# Altium schematic sheet RTC.SchDoc
size A; SheetNumber: 1; SheetTotal: 1
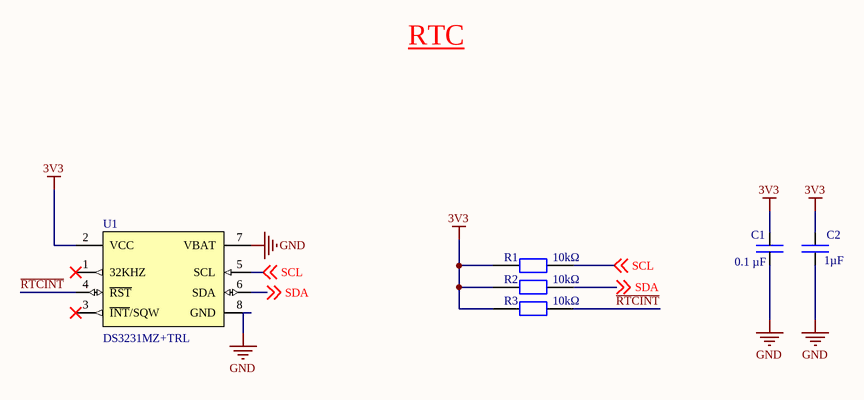
[diagram p0: RTC.SchDoc]

## Parts
C1  0.1 µF
C2  1µF
R1  10kΩ
R2  10kΩ
R3  10kΩ
U1  DS3231MZ+TRL  [DS3231MZ+TRL]

## Nets
3V3: C1.2 C2.1 R1.1 R2.1 R3.1 U1.2(VCC)
GND: C1.1 C2.2 U1.7(VBAT) U1.8(GND)
~{RTC}~{INT}: R3.2 U1.4(~{RST})
SCL: R1.2 U1.5(SCL) ; off-sheet SCL
SDA: R2.2 U1.6(SDA) ; off-sheet SDA

Not connected (* = marked no-connect by the designer): U1 1(32KHZ)* 3(~{INT}/SQW)*

## Notes on the sheet
- RTC

## Library data of the parts
C1 = C0402C104K7PACTU: Multilayer Ceramic Capacitors MLCC - SMD/SMT V 0.1uF X5R 0402 10%; Manufacturer: Yageo Group; Value: 100nF; Voltage Rating (DC): 4V; Supplier: DigiKey; Supplier Part Number: 399-14871-2-ND; Manufacturer Part Number: C0402C104K7PACTU; RoHS: Compliant; Category: Ceramic Capacitors; Stock: 10000; Pricing: 10000=0.01597, 20000=0.01478, 30000=0.01419, 50000=0.01353, 70000=0.01314, 100000=0.01277 (USD); Case/Package: 0402; China RoHS: Compliant; Dielectric: X5R; Dielectric Material: Ceramic; Height: 500µm; Lead Free: Lead Free; Length: 1mm; Lifecycle Status: Production; Max Operating Temperature: 85°C; Min Operating Temperature: -55°C; Mounting Technology: Surface Mount; Number of Terminals: 2; REACH SVHC: Yes; Width: 500µm; ComponentLink1URL: https://datasheet.octopart.com:443/C0402C104K7PACTU-KEMET-datasheet-178499189.pdf?src-supplier=IHS; ComponentLink1Description: https://datasheet.octopart.com:443/C0402C104K7PACTU-KEMET-datasheet-178499189.pdf?src-supplier=IHS; ComponentLink2URL: https://datasheet.octopart.com:443/C0402C104K7PACTU-KEMET-datasheet-137357760.pdf?src-supplier=Ciiva; ComponentLink2Description: https://datasheet.octopart.com:443/C0402C104K7PACTU-KEMET-datasheet-137357760.pdf?src-supplier=Ciiva; ComponentLink3URL: https://datasheet.octopart.com/C0402C104K7PACTU-KEMET-datasheet-84169754.pdf; ComponentLink3Description: https://datasheet.octopart.com/C0402C104K7PACTU-KEMET-datasheet-84169754.pdf
C2 = C0402C105K9PACTU: Multilayer Ceramic Capacitors MLCC – SMD/SMT; KEMET; C0402C105K9PACTU; 1 µF; 0402; 6.3 V; 6.3 V; Manufacturer: Yageo Group; Dielectric: X5R; Tolerance: 10%; Voltage: 6.3V; Supplier: DigiKey; Supplier Part Number: 399-C0402C105K9PACTUDKR-ND; Manufacturer Part Number: C0402C105K9PACTU; RoHS: Compliant; Category: Ceramic Capacitors; Stock: 8743639; Pricing: 1=0.1, 10=0.024, 50=0.0162, 100=0.0137, 500=0.0096, 1000=0.00835, 2500=0.00704, 5000=0.00625 (USD); Value: 1µF; Case/Package: 0402; Case Code (Imperial): 0402; China RoHS: Compliant; Country of Origin: Mexico; Depth: 500µm; Dielectric Material: Ceramic; Export Control Classification Number (ECCN) Code: EAR99; Height: 500µm; Harmonized Tariff Schedule (HTS) Code: 8532.24.00.20; Introduction Date: 2008-11-25; Lead Free: Lead Free; Lead Pitch: 300µm; Length: 1mm; Lifecycle Status: Production; Material: Ceramic; Max Operating Temperature: 85°C; Min Operating Temperature: -55°C; Mounting Technology: Surface Mount; Pins: 2; Number of Terminals: 2; Radiation Hardening: No; REACH SVHC: Yes; Schedule B: 8532240020, 8532240020|8532240020|8532240020|8532240020|8532240020|8532240020|8532240020|8532240020|8532240020|8532240020|8532240020|8532240020|8532240020|8532240020|8532240020|8532240020|8532240020|8532240020|8532240020|8532240020|8532240020|8532240020|8532240020|85; Termination: SMD/SMT; Thickness: 558.8µm; Voltage Rating: 6.3V; Voltage Rating (DC): 6.3V; Width: 500µm; ComponentLink1URL: https://datasheet.octopart.com:443/C0402C105K9PAC7867-KEMET-datasheet-179093065.pdf?src-supplier=IHS; ComponentLink1Description: https://datasheet.octopart.com:443/C0402C105K9PAC7867-KEMET-datasheet-179093065.pdf?src-supplier=IHS; ComponentLink2URL: https://datasheet.octopart.com:443/C0402C105K9PACTU-KEMET-datasheet-178499189.pdf?src-supplier=IHS; ComponentLink2Description: https://datasheet.octopart.com:443/C0402C105K9PACTU-KEMET-datasheet-178499189.pdf?src-supplier=IHS; ComponentLink3URL: https://datasheet.octopart.com:443/C0402C105K9PACTU-KEMET-datasheet-137357760.pdf?src-supplier=element14+APAC; ComponentLink3Description: https://datasheet.octopart.com:443/C0402C105K9PACTU-KEMET-datasheet-137357760.pdf?src-supplier=element14+APAC; ComponentLink4URL: https://datasheet.octopart.com:443/C0402C105K9PACTU-Kemet-datasheet-17019119.pdf?src-supplier=element14+APAC; ComponentLink4Description: https://datasheet.octopart.com:443/C0402C105K9PACTU-Kemet-datasheet-17019119.pdf?src-supplier=element14+APAC; ComponentLink5URL: https://datasheet.octopart.com:443/C0402C105K9PACTU-Kemet-datasheet-10978697.pdf?src-supplier=element14+APAC; ComponentLink5Description: https://datasheet.octopart.com:443/C0402C105K9PACTU-Kemet-datasheet-10978697.pdf?src-supplier=element14+APAC; ComponentLink6URL: https://datasheet.octopart.com:443/C0402C105K9PACTU-Kemet-datasheet-10547421.pdf?src-supplier=element14+APAC; ComponentLink6Description: https://datasheet.octopart.com:443/C0402C105K9PACTU-Kemet-datasheet-10547421.pdf?src-supplier=element14+APAC; ComponentLink7URL: https://datasheet.octopart.com:443/C0402C105K9PACTU-Kemet-datasheet-22084244.pdf?src-supplier=element14+APAC; ComponentLink7Description: https://datasheet.octopart.com:443/C0402C105K9PACTU-Kemet-datasheet-22084244.pdf?src-supplier=element14+APAC; ComponentLink8URL: https://datasheet.octopart.com:443/C0402C105K9PACTU-KEMET-datasheet-181956057.pdf?src-supplier=Farnell; ComponentLink8Description: https://datasheet.octopart.com:443/C0402C105K9PACTU-KEMET-datasheet-181956057.pdf?src-supplier=Farnell; ComponentLink9URL: https://datasheet.octopart.com:443/C0402C105K9PACTU-KEMET-datasheet-101575478.pdf?src-supplier=Farnell; ComponentLink9Description: https://datasheet.octopart.com:443/C0402C105K9PACTU-KEMET-datasheet-101575478.pdf?src-supplier=Farnell; ComponentLink10URL: https://datasheet.octopart.com:443/C0402C105K9PACTU-Kemet-datasheet-500041.pdf?src-supplier=Farnell; ComponentLink10Description: https://datasheet.octopart.com:443/C0402C105K9PACTU-Kemet-datasheet-500041.pdf?src-supplier=Farnell; ComponentLink11URL: https://datasheet.octopart.com:443/C0402C105K9PACTU-KEMET-datasheet-170667325.pdf?src-supplier=Farnell; ComponentLink11Description: https://datasheet.octopart.com:443/C0402C105K9PACTU-KEMET-datasheet-170667325.pdf?src-supplier=Farnell; ComponentLink12URL: https://datasheet.octopart.com:443/C0402C105K9PACTU-Kemet-datasheet-503297.pdf?src-supplier=Farnell; ComponentLink12Description: https://datasheet.octopart.com:443/C0402C105K9PACTU-Kemet-datasheet-503297.pdf?src-supplier=Farnell; ComponentLink13URL: https://datasheet.octopart.com:443/C0402C105K9PACTU-KEMET-datasheet-153476653.pdf?src-supplier=Electro+Sonic; ComponentLink13Description: https://datasheet.octopart.com:443/C0402C105K9PACTU-KEMET-datasheet-153476653.pdf?src-supplier=Electro+Sonic; ComponentLink14URL: https://datasheet.octopart.com:443/C0402C105K9PACTU-KEMET-datasheet-134136060.pdf?src-supplier=Electro+Sonic; ComponentLink14Description: https://datasheet.octopart.com:443/C0402C105K9PACTU-KEMET-datasheet-134136060.pdf?src-supplier=Electro+Sonic; ComponentLink15URL: https://datasheet.octopart.com:443/C0402C105K9PACTU-Kemet-datasheet-5314969.pdf?src-supplier=Newark; ComponentLink15Description: https://datasheet.octopart.com:443/C0402C105K9PACTU-Kemet-datasheet-5314969.pdf?src-supplier=Newark; ComponentLink16URL: https://datasheet.octopart.com:443/C0402C105K9PACTU-KEMET-datasheet-176289282.pdf?src-supplier=Newark; ComponentLink16Description: https://datasheet.octopart.com:443/C0402C105K9PACTU-KEMET-datasheet-176289282.pdf?src-supplier=Newark; ComponentLink17URL: https://datasheet.octopart.com:443/C0402C105K9PACTU-Kemet-datasheet-10978831.pdf?src-supplier=Newark; ComponentLink17Description: https://datasheet.octopart.com:443/C0402C105K9PACTU-Kemet-datasheet-10978831.pdf?src-supplier=Newark; ComponentLink18URL: https://datasheet.octopart.com:443/C0402C105K9PAC7867-KEMET-datasheet-188512140.pdf?src-supplier=ODG+(Origin+Data+Global); ComponentLink18Description: https://datasheet.octopart.com:443/C0402C105K9PAC7867-KEMET-datasheet-188512140.pdf?src-supplier=ODG+(Origin+Data+Global); ComponentLink19URL: https://datasheet.octopart.com:443/C0402C105K9PACTU-KEMET-datasheet-110724400.pdf?src-supplier=RS+(Formerly+Allied+Electronics); ComponentLink19Description: https://datasheet.octopart.com:443/C0402C105K9PACTU-KEMET-datasheet-110724400.pdf?src-supplier=RS+(Formerly+Allied+Electronics); ComponentLink20URL: https://datasheet.octopart.com:443/C0402C105K9PACTU-Kemet-datasheet-464.pdf?src-supplier=RS+(Formerly+Allied+Electronics); ComponentLink20Description: https://datasheet.octopart.com:443/C0402C105K9PACTU-Kemet-datasheet-464.pdf?src-supplier=RS+(Formerly+Allied+Electronics); ComponentLink21URL: https://datasheet.octopart.com:443/C0402C105K9PACTU-KEMET-datasheet-83957821.pdf?src-supplier=TME; ComponentLink21Description: https://datasheet.octopart.com:443/C0402C105K9PACTU-KEMET-datasheet-83957821.pdf?src-supplier=TME; ComponentLink22URL: https://datasheet.octopart.com:443/C0402C105K9PACTU-Kemet-datasheet-67830699.pdf?src-supplier=TME; ComponentLink22Description: https://datasheet.octopart.com:443/C0402C105K9PACTU-Kemet-datasheet-67830699.pdf?src-supplier=TME; ComponentLink23URL: https://datasheet.octopart.com:443/C0402C105K9PAC7867-Kemet-datasheet-62098572.pdf?src-supplier=TME; ComponentLink23Description: https://datasheet.octopart.com:443/C0402C105K9PAC7867-Kemet-datasheet-62098572.pdf?src-supplier=TME; ComponentLink24URL: https://datasheet.octopart.com:443/C0402C105K9PAC7867-Kemet-datasheet-17577222.pdf?src-supplier=TME; ComponentLink24Description: https://datasheet.octopart.com:443/C0402C105K9PAC7867-Kemet-datasheet-17577222.pdf?src-supplier=TME; ComponentLink25URL: https://datasheet.octopart.com/C0402C105K9PACTU-KEMET-datasheet-84169754.pdf; ComponentLink25Description: https://datasheet.octopart.com/C0402C105K9PACTU-KEMET-datasheet-84169754.pdf; ComponentLink26URL: http://sigma.octopart.com:80/conflict_mineral_statement/Yageo-company-3.pdf?src-supplier=Compliance+Statements; ComponentLink26Description: http://sigma.octopart.com:80/conflict_mineral_statement/Yageo-company-3.pdf?src-supplier=Compliance+Statements; ComponentLink27URL: http://sigma.octopart.com:80/rohs_statement/Yageo-company-2.pdf?src-supplier=Compliance+Statements; ComponentLink27Description: http://sigma.octopart.com:80/rohs_statement/Yageo-company-2.pdf?src-supplier=Compliance+Statements
R1-R3 = RT0805BRD0710KL: 125mW Thin Film Resistor 150V ±25ppm/℃ ±0.1% 10kΩ 0805 Chip Resistor - Surface Mount ROHS; Manufacturer: Yageo Group; Manufacturer Package Identifier: 0805 (2012 metric); Temperature Coefficient: 25ppm/°C; Supplier: DigiKey; Supplier Part Number: YAG1763CT-ND; Manufacturer Part Number: RT0805BRD0710KL; RoHS: Compliant; Category: Chip SMD Resistors; Stock: 86521; Pricing: 1=0.1, 10=0.08, 25=0.0744, 50=0.0704, 100=0.0665, 250=0.06172, 500=0.05842, 1000=0.05539 (USD); Case/Package: 0805; Case Code (Imperial): 0805; China RoHS: Non-Compliant; Composition: Thin Film; Country of Origin: Mainland China, Taiwan; Depth: 1.25mm; Export Control Classification Number (ECCN) Code: EAR99; Features: Moisture Resistant; Height: 500µm; Harmonized Tariff Schedule (HTS) Code: 8533.21.00.30; Introduction Date: 2008-06-09; Lead Free: Lead Free; Length: 2mm; Lifecycle Status: Production; Max Operating Temperature: 155°C; Max Power Dissipation: 125mW; Military Standard: Not; Min Operating Temperature: -55°C; Mounting Technology: Surface Mount; Number of Terminals: 2; Number of Terminations: 2; Power Rating: 125mW; REACH SVHC: Yes; Value: 10kΩ; Schedule B: 8533210045, 8533210045|8533210045|8533210045|8533210045|8533210045|8533210045|8533210045|8533210045|8533210045|8533210045|8533210045|8533210045|8533210045|8533210045|8533210045|8533210045|8533210045, 8533210045|8533210045|8533210045|8533210045|8533210045|8533210045|8533210045|8533210045|8533210045|8533210045|8533210045|8533210045|8533210045|8533210045|8533210045|8533210045|8533210045|8533210045, 8533210045|8533210045|8533210045|8533210045|8533210045|8533210045|8533210045|8533210045|8533210045|8533210045|8533210045|8533210045|8533210045|8533210045|8533210045|8533210045|8533210045|8533210045|8533210045; Termination: SMD/SMT; Tolerance: 0.1%; Voltage Rating: 150V; Voltage Rating (DC): 150V; Weight: 5.499807mg; Width: 1.25mm; Working Voltage: 150V; ComponentLink1URL: https://datasheet.octopart.com:443/RT0805BRD0710KL-Yageo-datasheet-176402239.pdf?src-supplier=Future+Electronics; ComponentLink1Description: https://datasheet.octopart.com:443/RT0805BRD0710KL-Yageo-datasheet-176402239.pdf?src-supplier=Future+Electronics; ComponentLink2URL: https://datasheet.octopart.com:443/RT0805BRD0710KL-Yageo-datasheet-169971040.pdf?src-supplier=Future+Electronics; ComponentLink2Description: https://datasheet.octopart.com:443/RT0805BRD0710KL-Yageo-datasheet-169971040.pdf?src-supplier=Future+Electronics; ComponentLink3URL: https://datasheet.octopart.com:443/RT0805BRD0710KL-Yageo-datasheet-166250672.pdf?src-supplier=Future+Electronics; ComponentLink3Description: https://datasheet.octopart.com:443/RT0805BRD0710KL-Yageo-datasheet-166250672.pdf?src-supplier=Future+Electronics; ComponentLink4URL: https://datasheet.octopart.com:443/RT0805BRD0710KL-Yageo-datasheet-136673517.pdf?src-supplier=Future+Electronics; ComponentLink4Description: https://datasheet.octopart.com:443/RT0805BRD0710KL-Yageo-datasheet-136673517.pdf?src-supplier=Future+Electronics; ComponentLink5URL: https://datasheet.octopart.com:443/RT0805BRD0710KL-Yageo-datasheet-137700930.pdf?src-supplier=Future+Electronics; ComponentLink5Description: https://datasheet.octopart.com:443/RT0805BRD0710KL-Yageo-datasheet-137700930.pdf?src-supplier=Future+Electronics; ComponentLink6URL: https://datasheet.octopart.com:443/RT0805BRD0710KL-Yageo-datasheet-12594463.pdf?src-supplier=Future+Electronics; ComponentLink6Description: https://datasheet.octopart.com:443/RT0805BRD0710KL-Yageo-datasheet-12594463.pdf?src-supplier=Future+Electronics; ComponentLink7URL: https://datasheet.octopart.com:443/RT0805BRD0710KL-Yageo-datasheet-8324589.pdf?src-supplier=Future+Electronics; ComponentLink7Description: https://datasheet.octopart.com:443/RT0805BRD0710KL-Yageo-datasheet-8324589.pdf?src-supplier=Future+Electronics; ComponentLink8URL: https://datasheet.octopart.com:443/RT0805BRD0710KL-Yageo-datasheet-34924148.pdf?src-supplier=Future+Electronics; ComponentLink8Description: https://datasheet.octopart.com:443/RT0805BRD0710KL-Yageo-datasheet-34924148.pdf?src-supplier=Future+Electronics; ComponentLink9URL: https://datasheet.octopart.com:443/RT0805BRD0710KL-Yageo-datasheet-96443642.pdf?src-supplier=Upverter; ComponentLink9Description: https://datasheet.octopart.com:443/RT0805BRD0710KL-Yageo-datasheet-96443642.pdf?src-supplier=Upverter; ComponentLink10URL: https://datasheet.octopart.com:443/RT0805BRD0710KL-Yageo-datasheet-10915759.pdf?src-supplier=TME; ComponentLink10Description: https://datasheet.octopart.com:443/RT0805BRD0710KL-Yageo-datasheet-10915759.pdf?src-supplier=TME; ComponentLink11URL: https://datasheet.octopart.com:443/RT0805BRD0710KL-Yageo-Group-datasheet-141265893.pdf?src-supplier=ODG+(Origin+Data+Global); ComponentLink11Description: https://datasheet.octopart.com:443/RT0805BRD0710KL-Yageo-Group-datasheet-141265893.pdf?src-supplier=ODG+(Origin+Data+Global); ComponentLink12URL: https://datasheet.octopart.com:443/RT0805BRD0710KL-Yageo-datasheet-120102479.pdf?src-supplier=Megastar; ComponentLink12Description: https://datasheet.octopart.com:443/RT0805BRD0710KL-Yageo-datasheet-120102479.pdf?src-supplier=Megastar; ComponentLink13URL: https://datasheet.octopart.com/RT0805BRD0710KL-Yageo-datasheet-86813807.pdf; ComponentLink13Description: https://datasheet.octopart.com/RT0805BRD0710KL-Yageo-datasheet-86813807.pdf; ComponentLink14URL: http://sigma.octopart.com:80/conflict_mineral_statement/Yageo-company-3.pdf?src-supplier=Compliance+Statements; ComponentLink14Description: http://sigma.octopart.com:80/conflict_mineral_statement/Yageo-company-3.pdf?src-supplier=Compliance+Statements; ComponentLink15URL: http://sigma.octopart.com:80/rohs_statement/Yageo-company-2.pdf?src-supplier=Compliance+Statements; ComponentLink15Description: http://sigma.octopart.com:80/rohs_statement/Yageo-company-2.pdf?src-supplier=Compliance+Statements
U1 = DS3231MZ+TRL: HH: MM: SS (12/24 hr) 128bit 2.3V 5.5V 2, I2C, Serial YY-MM-DD-dd SOIC-8 4.9mm*3.9mm*1.55mm; Manufacturer: Analog Devices; Manufacturer Lifecycle Status: PRODUCTION; Evaluation Kit: Yes; Logic Function: Clock; Operating Supply Voltage: 3.3V; Supplier: DigiKey; Supplier Part Number: 175-DS3231MZ+TRLCT-ND; Manufacturer Part Number: DS3231MZ+TRL; RoHS: Compliant; Category: Real Time Clocks; Stock: 7705; Pricing: 1=12.68, 10=9.957, 25=9.276, 100=8.5273, 250=8.30792 (USD); Case/Package: SOIC; Date Format: YY-MM-DD-dd; Interface: I2C; Lifecycle Status: Production; Max Operating Temperature: 85°C; Max Supply Voltage: 5.5V; Min Operating Temperature: -40°C; Min Supply Voltage: 2.3V; Mounting Technology: Surface Mount; Pins: 8; Packaging: Cut Tape; Radiation Hardening: No; REACH SVHC: Unknown; Schedule B: 8542390000|8542390000|8542390000|8542390000|8542390000|8542390000|8542390000|8542390000|8542390000|8542390000|8542390000|8542390000|8542390000|8542390000|8542390000|8542390000|8542390000|8542390000|8542390000|8542390000|8542390000|8542390000|8542390000|85; Time Format: HH:MM:SS (12/24 hr); ComponentLink1URL: https://octopart.com:443/opatz8j6/c1?t=VpmGs2zHwq00Ntx8-C9ikKrWpdgI_6obw9CoEXSkQfdREDwHx9U4_Gh7PrT9ZclzUn_6m4Pq1M-zYGe6wzlePTrl1SA5bCeYFsLi9k-K_BN8OYMW1V0JtQDIT4kcriXfwGGCwrRzvenitp_dqb225p-6G8oayRpm4GU0Y1emu0mIW65C5DaZ3BrlAfRfm8GYpCnrXLEmJEQyHcmUiA5Nzy8W1LVFDt8vFz8EnY90IgRDBtZDdZYAoJkwvFxciAvjGNj82WUZkEsiDwp3uyAXezmSTtNEHurlSpsIVX-KT_RE3oaxApzkU4du&src-supplier=Analog+Devices; ComponentLink1Description: https://octopart.com:443/opatz8j6/c1?t=VpmGs2zHwq00Ntx8-C9ikKrWpdgI_6obw9CoEXSkQfdREDwHx9U4_Gh7PrT9ZclzUn_6m4Pq1M-zYGe6wzlePTrl1SA5bCeYFsLi9k-K_BN8OYMW1V0JtQDIT4kcriXfwGGCwrRzvenitp_dqb225p-6G8oayRpm4GU0Y1emu0mIW65C5DaZ3BrlAfRfm8GYpCnrXLEmJEQyHcmUiA5Nzy8W1LVFDt8vFz8EnY90IgRDBtZDdZYAoJkwvFxciAvjGNj82WUZkEsiDwp3uyAXezmSTtNEHurlSpsIVX-KT_RE3oaxApzkU4du&src-supplier=Analog+Devices; ComponentLink2URL: https://datasheet.octopart.com:443/DS3231MZ%2BTRL-Dallas-Semiconductor-datasheet-13717986.pdf?src-supplier=Upverter; ComponentLink2Description: https://datasheet.octopart.com:443/DS3231MZ%2BTRL-Dallas-Semiconductor-datasheet-13717986.pdf?src-supplier=Upverter; ComponentLink3URL: https://datasheet.octopart.com:443/DS3231MZ%2BTRL-Analog-Devices-datasheet-62054857.pdf?src-supplier=LKR; ComponentLink3Description: https://datasheet.octopart.com:443/DS3231MZ%2BTRL-Analog-Devices-datasheet-62054857.pdf?src-supplier=LKR; ComponentLink4URL: https://datasheet.octopart.com:443/DS3231MZ%2BTRL-Maxim-Integrated-datasheet-159004021.pdf?src-supplier=Augswan; ComponentLink4Description: https://datasheet.octopart.com:443/DS3231MZ%2BTRL-Maxim-Integrated-datasheet-159004021.pdf?src-supplier=Augswan; ComponentLink5URL: https://sigma.octopart.com:443/138901689/technical_drawing/Maxim-Integrated-DS3231MZ%2BTRL.pdf?src-supplier=ShanghaiCT; ComponentLink5Description: https://sigma.octopart.com:443/138901689/technical_drawing/Maxim-Integrated-DS3231MZ%2BTRL.pdf?src-supplier=ShanghaiCT; ComponentLink6URL: https://datasheet.octopart.com:443/DS3231MZ%2BTRL-Analog-Devices-datasheet-166785826.pdf?src-supplier=Arrow.cn; ComponentLink6Description: https://datasheet.octopart.com:443/DS3231MZ%2BTRL-Analog-Devices-datasheet-166785826.pdf?src-supplier=Arrow.cn; ComponentLink7URL: http://sigma.octopart.com:80/conflict_mineral_statement/Analog-Devices-company-33.pdf?src-supplier=Compliance+Statements; ComponentLink7Description: http://sigma.octopart.com:80/conflict_mineral_statement/Analog-Devices-company-33.pdf?src-supplier=Compliance+Statements; ComponentLink8URL: http://sigma.octopart.com:80/reach_statement/Maxim-Integrated-company-67.pdf?src-supplier=Compliance+Statements; ComponentLink8Description: http://sigma.octopart.com:80/reach_statement/Maxim-Integrated-company-67.pdf?src-supplier=Compliance+Statements; ComponentLink9URL: http://sigma.octopart.com:80/rohs_statement/Maxim-Integrated-company-66.pdf?src-supplier=Compliance+Statements; ComponentLink9Description: http://sigma.octopart.com:80/rohs_statement/Maxim-Integrated-company-66.pdf?src-supplier=Compliance+Statements; ComponentLink10URL: http://sigma.octopart.com:80/conflict_mineral_statement/Maxim-Integrated-company-65.pdf?src-supplier=Compliance+Statements; ComponentLink10Description: http://sigma.octopart.com:80/conflict_mineral_statement/Maxim-Integrated-company-65.pdf?src-supplier=Compliance+Statements; ComponentLink11URL: https://octopart.com:443/opatz8j6/c1?t=O5yJd09fH_J-1-J7Sjpa8Psl9IfGxqzvmNEaE2vPwhX6krYTaPsKy1I9KkoB9rQXM3SgCLlmT5oBDBDTtZyhc1zDcDlc1aOxnE-J_wpiOqBfEYX8hFHqevKl8r9cHCoiIfwjzic-VURDx0gva05Lx4T5lPzB5IyMiPK7VCdNa558j-X2-LK2SStKHL9eLNqHayqDB_DqUtRK2yiq7i0mpCoEpnrWYypUsYqiEmKKvm8wmW-gOpJaGYgu_xqw4hITAyiYAztRLK6WjjeTTyeJa0m7jXSyuC6BBjwj42qGAEDvqlS3XScScTCX&src-supplier=Compliance+Statements; ComponentLink11Description: https://octopart.com:443/opatz8j6/c1?t=O5yJd09fH_J-1-J7Sjpa8Psl9IfGxqzvmNEaE2vPwhX6krYTaPsKy1I9KkoB9rQXM3SgCLlmT5oBDBDTtZyhc1zDcDlc1aOxnE-J_wpiOqBfEYX8hFHqevKl8r9cHCoiIfwjzic-VURDx0gva05Lx4T5lPzB5IyMiPK7VCdNa558j-X2-LK2SStKHL9eLNqHayqDB_DqUtRK2yiq7i0mpCoEpnrWYypUsYqiEmKKvm8wmW-gOpJaGYgu_xqw4hITAyiYAztRLK6WjjeTTyeJa0m7jXSyuC6BBjwj42qGAEDvqlS3XScScTCX&src-supplier=Compliance+Statements